# EAGLE design RTL_SDR_DSDAMP_0V1 (EAGLE 6.4)
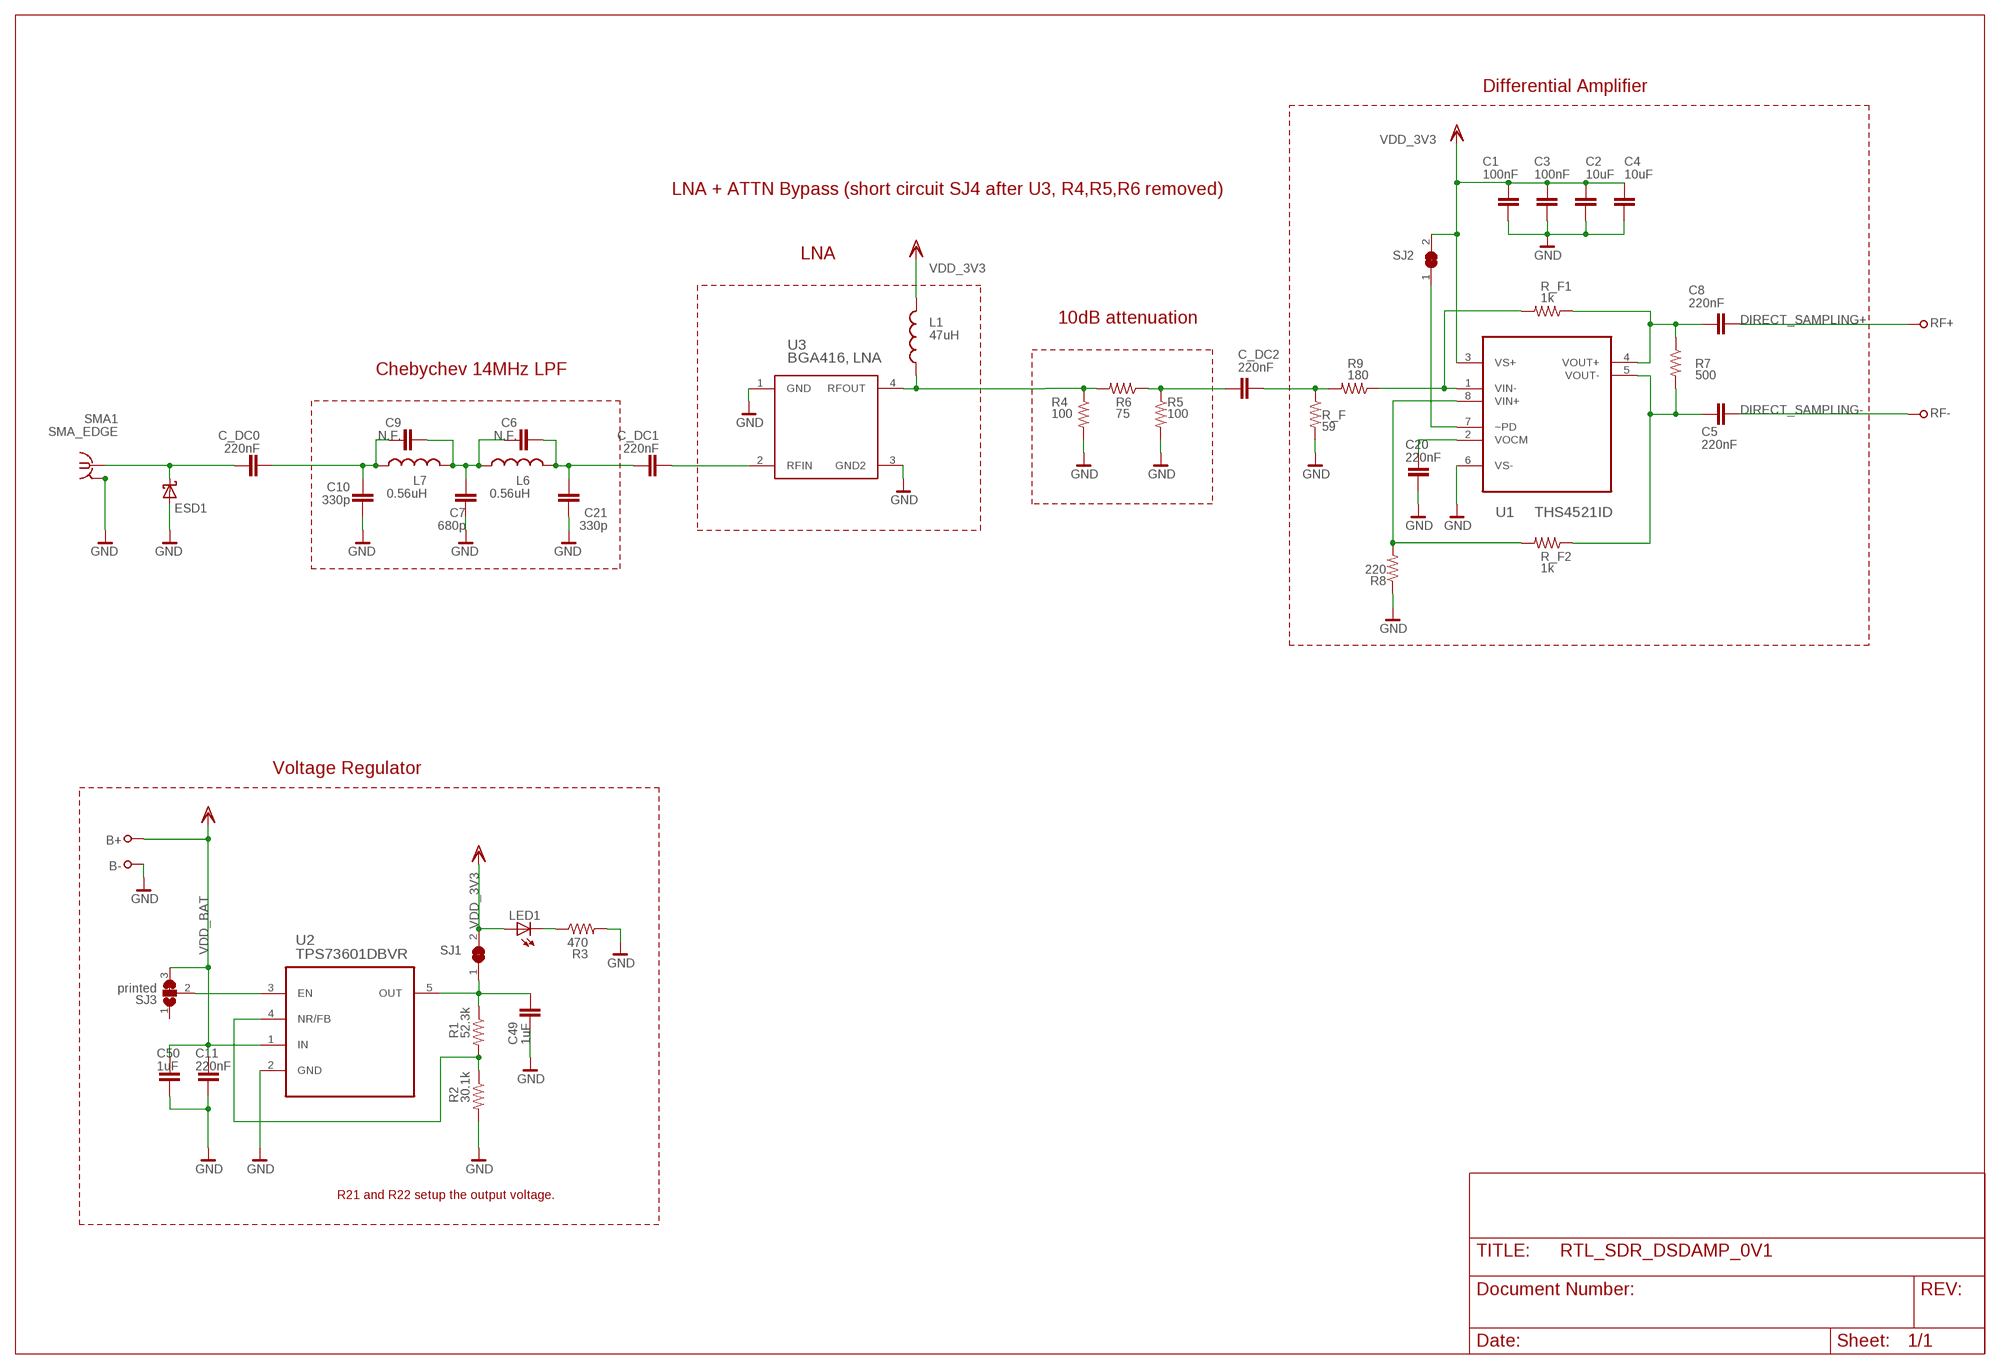
[diagram p0: schematic, sheet 1]

## Parts
B+  TESTPOINT39MIL  [TESTPOINT1,0]
B-  TESTPOINT39MIL  [TESTPOINT1,0]
C1  100nF  CAP-SMD0603  [0603]
C2  100nF  CAP-SMD0603  [0603]
C3  10uF  CAP-SMD0603  [0603]
C4  10uF  CAP-SMD0603  [0603]
C5  220nF  CAP-SMD0603  [0603]
C6  N.F.  CAP-SMD0603  [0603]
C7  680p  CAP-SMD0603  [0603]
C8  220nF  CAP-SMD0603  [0603]
C9  N.F.  CAP-SMD0603  [0603]
C10  330p  CAP-SMD0603  [0603]
C11  220nF  CAP-SMD0603  [0603]
C20  220nF  CAP-SMD0603  [0603]
C21  330p  CAP-SMD0603  [0603]
C49  1uF  CAP-SMD0603  [0603]
C50  1uF  CAP-SMD0603  [0603]
C_DC0  220nF  CAP-SMD0603  [0603]
C_DC1  220nF  CAP-SMD0603  [0603]
C_DC2  220nF  CAP-SMD0603  [0603]
ESD1  PGB1010603NRHF  SMF33A-GS08_ESD0603  [0603@1]
L1  47uH  INDUCTOR_L_1210  [L1210]
L6  0.56uH  INDUCTOR_L_1210  [L1210]
L7  0.56uH  INDUCTOR_L_1210  [L1210]
LED1  LED0603  [LED-0603]
R1  52.3k  R-US_R0603  [R0603]
R2  30.1k  R-US_R0603  [R0603]
R3  470  R-US_R0402  [R0402]
R4  100  R-US_R0603  [R0603]
R5  100  R-US_R0603  [R0603]
R6  75  R-US_R0603  [R0603]
R7  500  R-US_R0603  [R0603]
R8  220  R-US_R0603  [R0603]
R9  180  R-US_R0603  [R0603]
R_F  59  R-US_R0603  [R0603]
R_F1  1k  R-US_R0603  [R0603]
R_F2  1k  R-US_R0603  [R0603]
RF+  TESTPOINT39MIL  [TESTPOINT1,0]
RF-  TESTPOINT39MIL  [TESTPOINT1,0]
SJ1  printed  JUMPER_SMD_1  [JUMPER_SMD_SJ_1]
SJ2  printed  JUMPER_SMD_1  [JUMPER_SMD_SJ_1]
SJ3  printed  JUMPER_SMD_3A  [JUMPER_SMD_SJ2A]
SMA1  SMA_EDGE  [142-0701-801]
U1  THS4521ID  [SOIC127P600X175-8N]
U2  TPS73601DBVR  [SOT95P280X145-5N]
U3  BGA416, LNA  BGA416  [SOT143]

## Nets
DIRECT_SAMPLING+: C8.1 RF+.1
DIRECT_SAMPLING-: C5.1 RF-.1
GND: B-.1 C1.1 C2.1 C3.1 C4.1 C7.1 C10.1 C11.1 C20.1 C21.1 C49.1 C50.1 ESD1.1(A) R2.2 R3.2 R4.2 R5.2 R8.1 R_F.2 SMA1.RING@1 SMA1.RING@2 SMA1.RING@3 SMA1.RING@4 U1.6(VS-) U2.2(GND) U3.1(GND) U3.3(GND2)
N$1: LED1.C R3.1
N$2: L1.2 R4.1 R6.2 U3.4(RFOUT)
N$4: C6.2 C21.2 C_DC1.1 L6.1
N$5: C9.1 C10.2 C_DC0.2 L7.2
N$6: C49.2 R1.1 SJ1.1 U2.5(OUT)
N$7: C5.2 R7.2 R_F2.1 U1.5(VOUT-)
N$8: C8.2 R7.1 R_F1.1 U1.4(VOUT+)
N$9: C_DC1.2 U3.2(RFIN)
N$10: C6.1 C7.2 C9.2 L6.2 L7.1
N$11: C20.2 U1.2(VOCM)
N$12: R1.2 R2.1 U2.4(NR/FB)
N$13: SJ2.1 U1.7(~PD)
N$14: R8.2 R_F2.2 U1.8(VIN+)
N$16: SJ3.2 U2.3(EN)
N$17: C_DC2.1 R5.1 R6.1
N$18: R9.1 R_F1.2 U1.1(VIN-)
N$20: C_DC0.1 ESD1.2(C) SMA1.TIP
N$21: C_DC2.2 R9.2 R_F.1
VDD_3V3: C1.2 C2.2 C3.2 C4.2 L1.1 LED1.A SJ1.2 SJ2.2 U1.3(VS+)
VDD_BAT: B+.1 C11.2 C50.2 SJ3.3 U2.1(IN)
Unconnected: SJ3.1

## Notes on the sheet
- Differential Amplifier
- LNA + ATTN Bypass (short circuit SJ4 after U3, R4,R5,R6 removed)
- LNA
- 10dB attenuation
- Chebychev 14MHz LPF
- Voltage Regulator
- R21 and R22 setup the output voltage.

## Library data of the parts
B+ B- RF+ RF- = dzo:TESTPOINT
C1-C11 C21 C49 C50 C_DC0 C_DC1 C_DC2 = dzo:CAP-SMD
C20 = lve_modositott:CAP-SMD
ESD1 = dzo:SMF33A-GS08_ESD
L1 L6 L7 = dzo:INDUCTOR_L_1210; DESCR: Inductor, wirewound; MANUF: TDK; MANUFNR: NLCV32 series
LED1 = dzo:LED: LEDs Standard schematic elements and footprints for 5mm, 3mm, 1206, and 0603 sized LEDs. 5mm - Spark Fun Electronics SKU : COM-00529 (and others)
R1-R9 R_F R_F1 R_F2 = resistor:R-US_: RESISTOR, American symbol
SJ1 SJ2 = dzo:JUMPER_SMD_1
SJ3 = lve_modositott:JUMPER_SMD_3A
SMA1 = dzo:SMA_EDGE: RF Connectors PCB END MT JCK GLD .062" BOARD THICK; DISTRI: Mouser; DISTRINR: 530-142-0701-801; PARTNR: 142-0701-801; VENDOR: Emerson Conectivity
U1 = dzo:THS4521ID: VERY LOW POWER, NEGATIVE RAIL INPUT, RAIL-TO-RAIL OUTPUT FULLY DIFFERENTIAL AMPLIFIER; MPN: THS4521ID; OC_FARNELL: 1755707; OC_NEWARK: 45P2938; PACKAGE: SOIC-8; SUPPLIER: Texas Instruments
U2 = dzo:TPS73601DBVR: Cap-Free, NMOS, 400mA Low-Dropout Regulator with Reverse Current Protection; ALTDISTRI_NEWARK: 87H2971; DISTRI: Farnell; DISTRINR: 1576489; PACKAGE: SOT-23-5; PARTNR: TPS73601DBVR; VENDOR: Texas Instruments
U3 = dzo:BGA416: RF Cascode Amplifier, Typical supply voltage: 2.5 to 5.0 V; DISTRI: Farnell; DISTRINR: 2480586

## Board
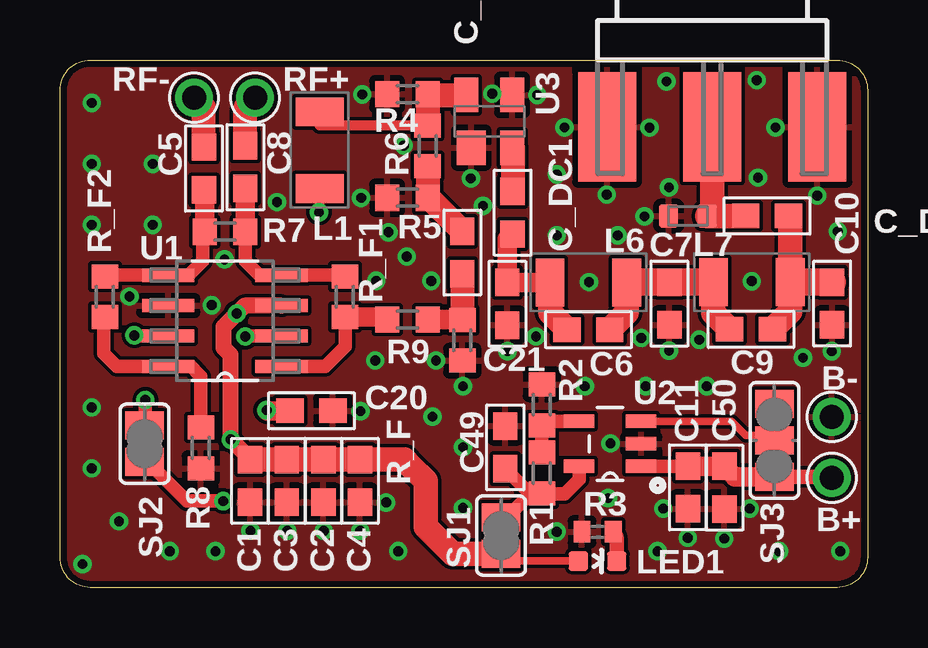
[diagram p1: board, top side]
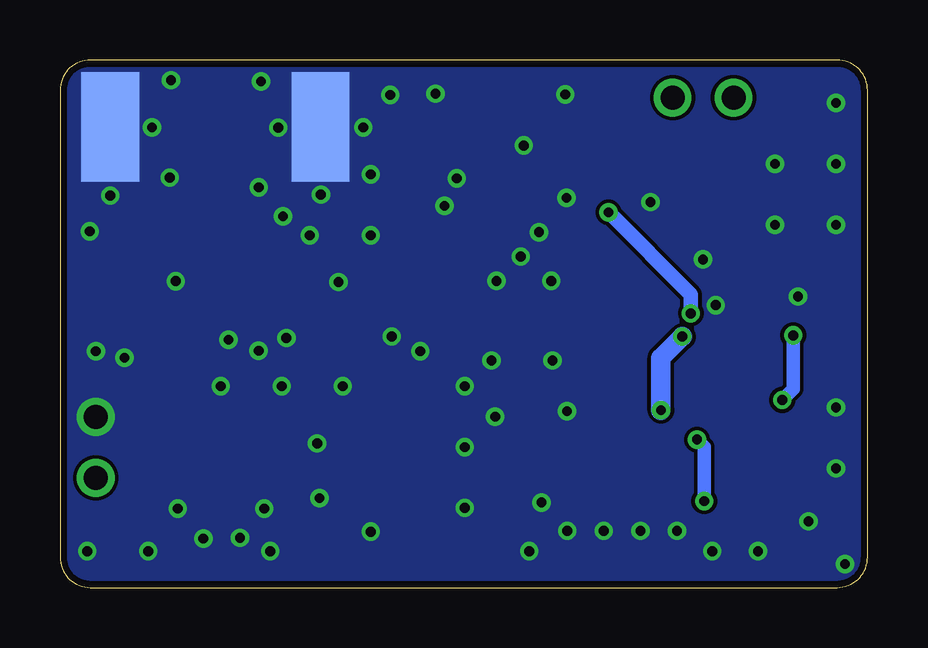
[diagram p2: board, bottom side, seen from below]

Size 33.65 x 22 mm. Coordinates in mm from the lower left corner, seen from the top.
Outline: 33.65,20.73 33.65,1.27 arc-90 32.38,0 1.27,0 arc-90 0,1.27 0,20.73 arc-90 1.27,22 32.38,22 arc-90 33.65,20.73
Copper layers (1*16): Top 0.035mm / dielectric 1.5mm / Bottom 0.035mm
Design rules "ITEADstudio_DRC_cream_mask_ok *": minimum track width 6mil, minimum drill 12mil, track to track 6mil, track to pad 6mil, pad to pad 6mil, via to via 6mil, smd to smd 0mil, copper to edge 10mil, drill to drill 10mil, minimum pad ring 10mil, minimum via ring 7mil, stop-mask expansion 0mil, vias tented up to drill 100mil, thermal gap 10mil

### Footprints (pad centres in the part's own frame; a part is rotated, then mirrored left to right if it is on the bottom)
TESTPOINT1,0 = drill 1 pad 1.575: 1 0,0
0603 = smd 1.143 x 1.016: 1 -0.889,0; 2 0.889,0
0603@1 = smd 0.8 x 0.95: 1 -0.8,0; 2 0.8,0
L1210 = smd 1.2 x 2: 1 -1.6,0; 2 1.6,0
LED-0603 = smd 0.8 x 0.8: A 0,-0.8; C 0,0.8
R0603 = smd 1 x 1.1: 1 -0.85,0; 2 0.85,0
R0402 = smd 0.7 x 0.9: 1 -0.65,0; 2 0.65,0
JUMPER_SMD_SJ_1 = smd 1.168 x 1.6: 1 -0.762,0; 2 0.762,0
JUMPER_SMD_SJ2A = smd 1.168 x 1.6: 1 -1.524,0; 2 0,0; 3 1.524,0
142-0701-801 = smd 2.413 x 4.572: RING@1 -4.381,-2.794; RING@2 4.381,-2.794; TIP 0,-2.794 | smd 2.413 x 4.572 bottom: RING@3 -4.381,-2.794; RING@4 4.381,-2.794
SOIC127P600X175-8N = smd 2.184 x 0.559: 1 -2.362,1.905; 2 -2.362,0.635; 3 -2.362,-0.635; 4 -2.362,-1.905; 5 2.362,-1.905; 6 2.362,-0.635; 7 2.362,0.635; 8 2.362,1.905
SOT95P280X145-5N = smd 1.27 x 0.559: 1 -1.295,0.94; 2 -1.295,0; 3 -1.295,-0.94; 4 1.295,-0.94; 5 1.295,0.94
SOT143 = smd 1.2 x 1.44: 1 -0.75,-1.1 | smd 1 x 1.44: 2 0.95,-1.1; 3 0.95,1.1; 4 -0.95,1.1

### Placement (x,y rotation side)
B+  32.16,4.57 0 top
B-  32.16,7.11 90 top
C1  7.92,4.45 90 top
C2  10.97,4.45 90 top
C3  9.45,4.45 90 top
C4  12.5,4.45 90 top
C5  5.99,17.48 270 top
C6  22.02,10.75 180 top
C7  25.39,11.84 90 top
C8  7.72,17.53 270 top
C9  28.79,10.77 180 top
C10  32.17,11.84 90 top
C11  26.16,4.18 90 top
C20  10.48,7.37 180 top
C21  18.64,11.83 90 top
C49  18.55,5.84 270 top
C50  27.68,4.17 90 top
C_DC0  29.46,15.49 0 top
C_DC1  18.86,15.63 90 top
C_DC2  16.76,13.97 270 top
ESD1  26.16,15.49 0 top
L1  10.82,18.24 90 top
L6  22.02,12.73 0 top
L7  28.83,12.73 0 top
LED1  22.4,1.11 270 top
R1  20.08,4.78 90 top
R2  20.08,7.62 90 top
R3  22.4,2.33 180 top
R4  14.48,20.57 180 top
R5  14.48,16.26 180 top
R6  15.31,18.41 90 top
R7  6.87,14.84 180 top
R8  5.87,5.83 90 top
R9  14.48,11.18 0 top
R_F  16.76,10.31 270 top
R_F1  11.87,12.12 270 top
R_F2  1.87,12.12 270 top
RF+  8.13,20.42 270 top
RF-  5.59,20.42 0 top
SJ1  18.38,2.17 270 top
SJ2  3.52,6 270 top
SJ3  29.77,6.14 270 top
SMA1  27.18,22 0 top
U1  6.87,11.12 180 top
U2  22.92,5.99 180 top
U3  17.89,19.44 0 top

### Tracks (layer width: path | path; a pad name or v marks a point on that pad's centre or on a via)
DIRECT_SAMPLING+
  Top 0.991: C8.1 7.72,20.02 RF+.1
DIRECT_SAMPLING-
  Top 0.991: C5.1 5.99,20.02 RF-.1
GND  (via drill 0.41)
  other vias: 30.96,9.58 19.89,20.54 22.94,6.01 12.6,20.57 32.16,9.85 25.37,9.88 18.64,9.85 21.02,19.19 31.56,16.34 24.36,15.48 23.24,14.69 29.82,19.19 24.22,10.41 26.63,10.33 19.83,10.47 24.56,19.18 26.15,2.07 27.68,2.04 7.94,2.37 9.47,2.37 10.99,2.37 12.51,2.37 16.79,8.4 15.67,9.47 13.59,3.55 12.55,16.25 18.01,20.59 22.78,16.38 25.27,21.11 29.03,21.16 29.08,17.09 25.37,16.69 25.14,3.29 28.74,3.29 2.46,2.76 4.57,1.52 16.79,5.86 16.79,3.32 20.7,2.33 22.83,3.72 21.87,8.4 24.41,8.4 26.95,8.4 24.89,1.52 29.97,1.52 32.51,1.52 32.41,14.85 20.7,14.69 20.7,17.23 13.18,12.79 6.32,11.78 2.9,12.13 1.32,4.97 1.32,7.51 1.32,15.13 1.32,17.67 1.32,20.21 3.86,17.67 3.86,15.13 13.13,9.47 6.86,13.68 17.63,15.92 17.12,17.06 14.33,18.43 15.47,12.79 13.69,14.82 14.45,13.8 0.94,0.98 28.83,12.78 22.05,12.74 12.52,7.36 14.1,1.52 6.48,1.52 15.52,7.13 9.04,16.07
  pour Bottom (rank 2, no thermals): 33.65,22 33.65,0 0.02,0 0.02,22.03
  pour Top (rank 2): 33.65,22 33.65,0 0.02,0 0.02,22.03
N$1
  Top 0.61: R3.1 arc-45 23.2,1.96 LED1.C
N$2
  Top 0.406: L1.2 10.82,19.28 12.52,19.28 R6.2
  Top 0.991: U3.4 15.36,20.54 R4.1 15.31,20.56 R6.2
N$4
  Top 0.813: C21.2 | C21.2 L6.1 | C21.2 18.65,14.52 C_DC1.1
  Top 1.016: C6.2 20.42,11.46 L6.1
  Top 1.143: L6.1
N$5
  Top 1.016: C9.1 30.43,11.52 L7.2 30.43,15.42 C_DC0.2
  Top 1.143: C10.2 L7.2
N$6
  Top 0.559: U2.5 21.63,4.51 21.03,3.91 20.09,3.91 R1.1 | R1.1 19.62,3.92 19.18,3.48 18.63,2.93 SJ1.1 | C49.2 19.68,3.82 19.68,3.81 19.8,3.92 R1.1
N$7
  Top 0.559: R_F2.1 1.93,13.03 U1.5 5.36,13.03 5.94,13.61 5.94,14.76 R7.2
  Top 0.813: R7.2 6.02,16.45 C5.2
N$8
  Top 0.559: R_F1.1 11.82,13.03 U1.4 8.31,13.03 8.13,13.21 7.72,13.61 R7.1
  Top 0.813: R7.1 7.72,16.49 C8.2
N$9
  Top 0.991: U3.2 18.86,18.32 C_DC1.2
  Top 1.016: 18.86,18.34 U3.2
N$10
  Top 0.559: L6.2 | L6.2 C7.2
  Top 1.016: C9.2 27.23,11.45 L7.1 | C6.1 23.62,11.46 L6.2
  Top 1.143: L7.1 L6.2
N$11  (via drill 0.41)
  Top 0.559: U1.2 7.74,10.49 v7.72,10.46 | v8.61,7.39 8.63,7.37
  Top 0.813: C20.2 8.63,7.37 v8.61,7.39
  Bottom 0.559: 7.72,10.52 v7.72,10.46
  Bottom 0.813: v8.61,7.39 8.61,9.58 v7.72,10.46
N$12
  Top 0.559: R1.2 R2.1 20.24,6.93 U2.4
N$13  (via drill 0.41)
  Top 0.559: U1.7 3.12,10.49 v3.1,10.52 | v3.55,7.82 3.55,6.79 SJ2.1
  Bottom 0.559: v3.1,10.52 3.1,8.28 v3.55,7.82
N$14
  Top 0.559: R_F2.2 1.83,11.23 1.83,9.75 2.36,9.22 U1.8 5.46,9.22 5.79,8.89 5.87,8.81 R8.2
N$16
  Top 0.305: U2.3 27.99,6.93 28.57,6.35 29.55,6.35 SJ3.2
N$17
  Top 0.991: R6.1 R5.1 15.37,16.26 C_DC2.1
N$18
  Top 0.559: U1.1 11.05,9.22 11.89,10.06 11.89,11.26 R_F1.2
  Top 0.813: R9.1 13.53,11.27 R_F1.2
N$20
  Top 1.016: C_DC0.1 ESD1.2 arc45 27.18,16.02 SMA1.TIP
N$21
  Top 0.813: R_F.1 16.75,11.18 R9.2
  Top 0.991: C_DC2.2 R_F.1
VDD_3V3  (via drill 0.41)
  Top 0.305: LED1.A 18.68,1.11 SJ1.2
  Top 0.406: L1.1 10.79,16.61 v10.79,15.65
  Top 0.559: 3.55,5.2 SJ2.2 3.65,5.24 4.32,4.57 5.28,3.61 v6.81,3.61 | C1.2 7.92,5.36 | 6.91,10.97 6.81,10.87
  Top 0.66: 7.92,5.36 v7.11,6.17 7.11,9.25 7.11,9.7 6.81,10.01 6.81,10.87 | U1.3 7.69,11.76 v7.36,11.43 6.91,10.97
  Top 1.016: C1.2 C3.2 C2.2 C4.2 14.35,5.33 14.6,5.08 15.24,4.45 15.24,2.54 16.37,1.41 SJ1.2
  Bottom 0.559: v6.81,3.61 6.81,4.22 6.81,5.87 v7.11,6.17
  Bottom 0.61: v10.79,15.65 7.36,12.22 v7.36,11.43
VDD_BAT
  Top 0.559: U2.1 26.15,5.05 C11.2
  Top 0.61: B+.1 32.12,4.61 SJ3.3
  Top 0.813: SJ3.3 28.12,4.61 C50.2 26.17,5.05 C11.2

### Text on the board
Top: TOP
Bottom: BOTTOM